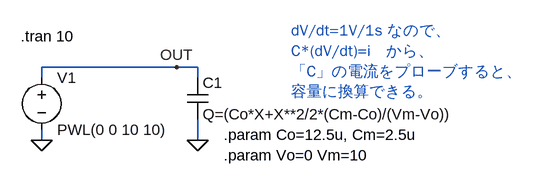
[diagram p0: schematic Fig_2-96_VdepndCap_Linear_DC.asc]
Fig_2-96_VdepndCap_Linear_DC.asc, the LTspice schematic file:
Version 4
SHEET 1 880 680
WIRE 256 112 48 112
WIRE 288 112 256 112
WIRE 48 128 48 112
WIRE 288 128 288 112
WIRE 48 224 48 208
WIRE 288 224 288 192
FLAG 48 224 0
FLAG 288 224 0
FLAG 256 112 OUT
SYMBOL voltage 48 112 R0
WINDOW 123 0 0 Left 0
WINDOW 39 0 0 Left 0
SYMATTR InstName V1
SYMATTR Value PWL(0 0 10 10)
SYMBOL cap 272 128 R0
SYMATTR InstName C1
SYMATTR Value Q=(Co*X+X**2/2*(Cm-Co)/(Vm-Vo))
TEXT 16 64 Left 2 !.tran 10
TEXT 328 216 Left 2 !.param Co=12.5u, Cm=2.5u\n.param Vo=0 Vm=10
TEXT 432 56 Left 2 ;dV/dt=1V/1s なので、\nC*(dV/dt)=i　から、\n「C」の電流をプローブすると、\n容量に換算できる。

The netlist it stands for:
* Fig_2-96_VdepndCap_Linear_DC.asc
V1 OUT 0 PWL(0 0 10 10)
C1 OUT 0 Q=(Co*X+X**2/2*(Cm-Co)/(Vm-Vo))
.tran 10
.param Co=12.5u, Cm=2.5u
.param Vo=0 Vm=10
* dV/dt=1V/1s なので、
* C*(dV/dt)=i　から、
* 「C」の電流をプローブすると、
* 容量に換算できる。
.backanno
.end